# EAGLE schematic ENGI301_Maze_Project (EAGLE 8.7.1)
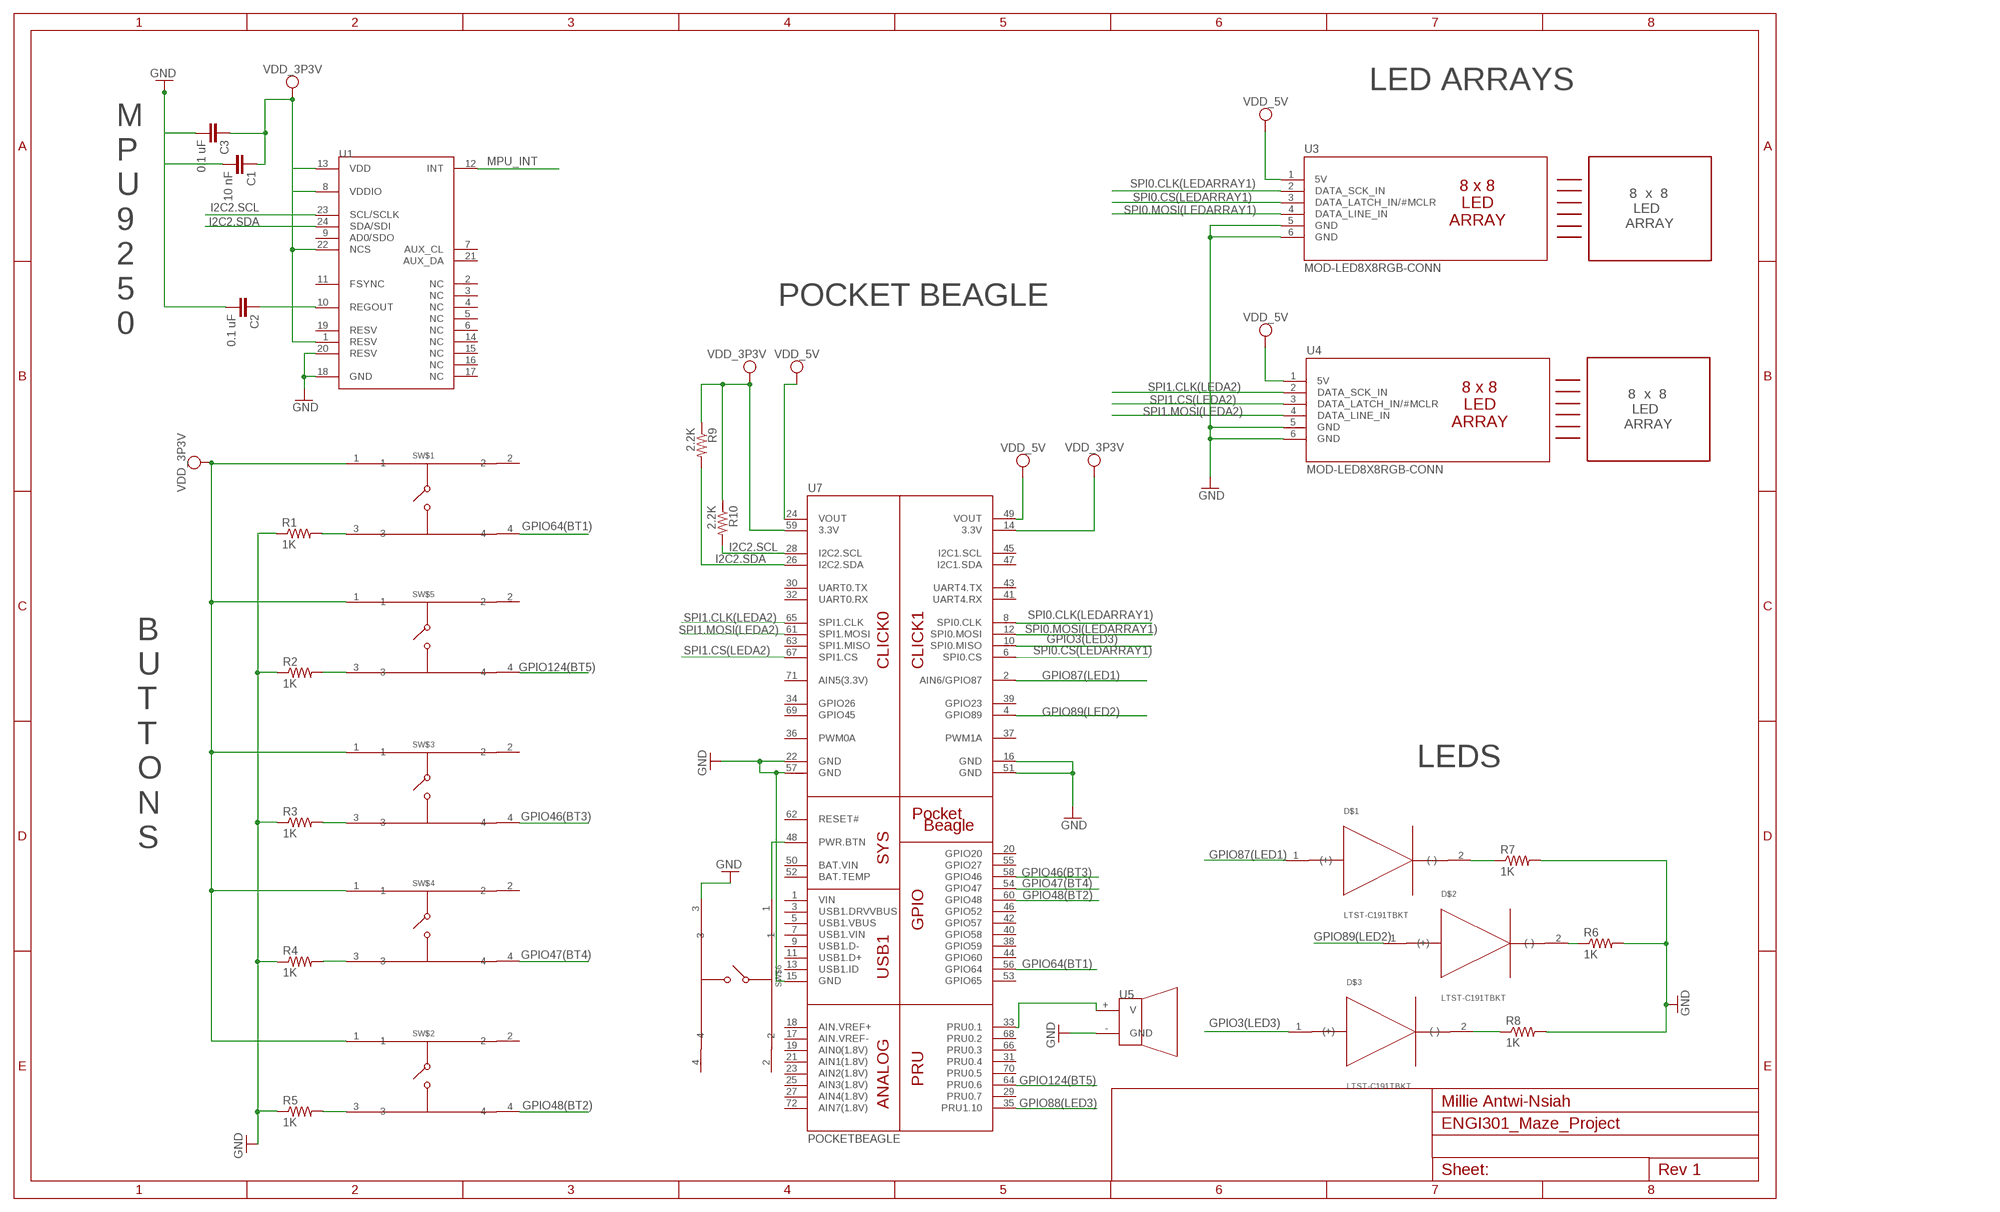
[diagram p0: schematic, sheet 1]

## Parts
C1  10 nF  C_C0603  [C0603]
C2  0.1 uF  C_C0603  [C0603]
C3  0.1 uF  C_C0603  [C0603]
D$1  LTST-C191TBKT  [LTST-C191TBKT]
D$2  LTST-C191TBKT  [LTST-C191TBKT]
D$3  LTST-C191TBKT  [LTST-C191TBKT]
R1  1K  R_R0603  [R0603]
R2  1K  R_R0603  [R0603]
R3  1K  R_R0603  [R0603]
R4  1K  R_R0603  [R0603]
R5  1K  R_R0603  [R0603]
R6  1K  R_R0603  [R0603]
R7  1K  R_R0603  [R0603]
R8  1K  R_R0603  [R0603]
R9  2.2K  R_R0603  [R0603]
R10  2.2K  R_R0603  [R0603]
SW$1  TACTILE-BUTTON  [TACTILE-BUTTON]
SW$2  TACTILE-BUTTON  [TACTILE-BUTTON]
SW$3  TACTILE-BUTTON  [TACTILE-BUTTON]
SW$4  TACTILE-BUTTON  [TACTILE-BUTTON]
SW$5  TACTILE-BUTTON  [TACTILE-BUTTON]
SW$6  TACTILE-BUTTON  [TACTILE-BUTTON]
U1  MPU-9250  [QFN3MMX3MM]
U3  MOD-LED8X8RGB-CONN  [FE06W]
U4  MOD-LED8X8RGB-CONN  [FE06W]
U5  CEM-1203  [CEM-1203]
U7  POCKETBEAGLE  [POCKETBEAGLE]

## Nets
GND: C1.2 C2.2 C3.2 R1.1 R2.1 R3.1 R4.1 R5.1 R7.2 R8.2 SW$6.3 U1.18(GND) U1.20(RESV) U3.5(GND) U3.6(GND) U4.5(GND) U4.6(GND) U5.-(GND) U7.16(GND) U7.22(GND) U7.51(GND)
GPIO3(LED3): D$3.1((+)) U7.10(SPI0.MISO)
GPIO46(BT3): SW$3.4 U7.58(GPIO46)
GPIO47(BT4): SW$4.4 U7.54(GPIO47)
GPIO48(BT2): SW$2.4 U7.60(GPIO48)
GPIO64(BT1): SW$1.4 U7.56(GPIO64)
GPIO87(LED1): D$1.1((+)) U7.2(AIN6/GPIO87)
GPIO88(LED3): U7.35(PRU1.10)
GPIO89(LED2): D$2.1((+)) U7.4(GPIO89)
GPIO124(BT5): SW$5.4 U7.64(PRU0.6)
I2C2.SCL: R10.2 U1.23(SCL/SCLK) U7.28(I2C2.SCL)
I2C2.SDA: R9.2 U1.24(SDA/SDI) U7.26(I2C2.SDA)
MPU_INT: U1.12(INT)
N$1: R5.2 SW$2.3
N$2: R4.2 SW$4.3
N$3: R3.2 SW$3.3
N$4: R2.2 SW$5.3
N$5: R1.2 SW$1.3
N$8: D$1.2((-)) R7.1
N$9: D$2.2((-)) R6.1
N$10: R6.2
N$14: D$3.2((-)) R8.1
N$15: SW$6.1 U7.48(PWR.BTN)
N$16: U7.57(GND)
N$18: U7.15(GND)
N$19: U5.+(V) U7.33(PRU0.1)
N$25: C2.1 U1.10(REGOUT)
SPI0.CLK(LEDARRAY1): U3.2(DATA_SCK_IN) U7.8(SPI0.CLK)
SPI0.CS(LEDARRAY1): U3.3(DATA_LATCH_IN/#MCLR) U7.6(SPI0.CS)
SPI0.MOSI(LEDARRAY1): U3.4(DATA_LINE_IN) U7.12(SPI0.MOSI)
SPI1.CLK(LEDA2): U4.2(DATA_SCK_IN) U7.65(SPI1.CLK)
SPI1.CS(LEDA2): U4.3(DATA_LATCH_IN/#MCLR) U7.67(SPI1.CS)
SPI1.MOSI(LEDA2): U4.4(DATA_LINE_IN) U7.61(SPI1.MOSI)
SYS_VDD1_3P3V: C1.1 C3.1 R9.1 R10.1 SW$1.1 SW$2.1 SW$3.1 SW$4.1 SW$5.1 U1.1(RESV) U1.8(VDDIO) U1.13(VDD) U1.22(NCS) U7.14(3.3V) U7.59(3.3V) ; supply symbol labelled VDD_3P3V
SYS_VDD1_5V: U3.1(5V) U4.1(5V) U7.24(VOUT) ; supply symbol labelled VDD_5V
SYS_VDD2_5V: U7.49(VOUT) ; supply symbol labelled VDD_5V
Unconnected: SW$1.2 SW$2.2 SW$3.2 SW$4.2 SW$5.2 SW$6.2 SW$6.4 U1.2(NC) U1.3(NC) U1.4(NC) U1.5(NC) U1.6(NC) U1.7(AUX_CL) U1.9(AD0/SDO) U1.11(FSYNC) U1.14(NC) U1.15(NC) U1.16(NC) U1.17(NC) U1.19(RESV) U1.21(AUX_DA) U7.1(VIN) U7.3(USB1.DRVVBUS) U7.5(USB1.VBUS) U7.7(USB1.VIN) U7.9(USB1.D-) U7.11(USB1.D+) U7.13(USB1.ID) U7.17(AIN.VREF-) U7.18(AIN.VREF+) U7.19(AIN0(1.8V)) U7.20(GPIO20) U7.21(AIN1(1.8V)) U7.23(AIN2(1.8V)) U7.25(AIN3(1.8V)) U7.27(AIN4(1.8V)) U7.29(PRU0.7) U7.30(UART0.TX) U7.31(PRU0.4) U7.32(UART0.RX) U7.34(GPIO26) U7.36(PWM0A) U7.37(PWM1A) U7.38(GPIO59) U7.39(GPIO23) U7.40(GPIO58) U7.41(UART4.RX) U7.42(GPIO57) U7.43(UART4.TX) U7.44(GPIO60) U7.45(I2C1.SCL) U7.46(GPIO52) U7.47(I2C1.SDA) U7.50(BAT.VIN) U7.52(BAT.TEMP) U7.53(GPIO65) U7.55(GPIO27) U7.62(RESET#) U7.63(SPI1.MISO) U7.66(PRU0.3) U7.68(PRU0.2) U7.69(GPIO45) U7.70(PRU0.5) U7.71(AIN5(3.3V)) U7.72(AIN7(1.8V))

## Notes on the sheet
- LED ARRAYS
- 8  x  8                                      
     LED
   ARRAY
- POCKET BEAGLE
- M
  P
  U
  9
  2
  5
  0
- 8  x  8                                      
     LED
   ARRAY
- LEDS
- B
  U
  T
  T
  O
  N
  S
- Millie Antwi-Nsiah

## Library data of the parts
C1-C3 = 3-29-2018 Class:C_: Capacitor SMD. Sizes: 0402, 0603 & 0805
D$1-D$3 = 3-29-2018 Class:LTST-C191TBKT: SMD LED
R1-R10 = 3-29-2018 Class:R_: RESISTOR, American symbol
SW$1-SW$6 = 3-29-2018 Class:TACTILE-BUTTON
U1 = 3-29-2018 Class:MPU-9250: MPU-9250
U3 U4 = 3-29-2018 Class:MOD-LED8X8RGB-CONN
U5 = 3-29-2018 Class:CEM-1203: Magnetic buzzer
U7 = 3-29-2018 Class:POCKETBEAGLE